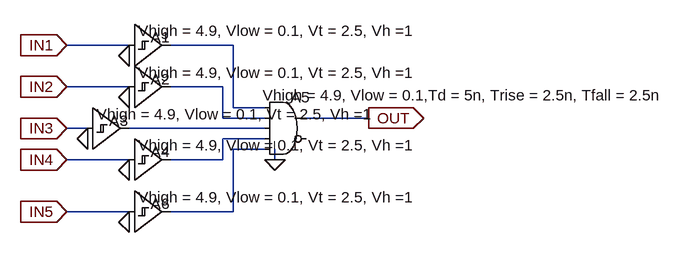
[diagram p0: schematic Draft1.asc]
Draft1.asc, the LTspice schematic file:
Version 4.1
SHEET 1 880 680
WIRE 48 -544 -48 -544
WIRE 208 -544 112 -544
WIRE 48 -480 -48 -480
WIRE 192 -480 112 -480
WIRE 208 -448 208 -544
WIRE 256 -448 208 -448
WIRE 192 -432 192 -480
WIRE 256 -432 192 -432
WIRE 416 -432 320 -432
WIRE -16 -416 -48 -416
WIRE 256 -416 48 -416
WIRE 256 -400 192 -400
WIRE 256 -384 208 -384
WIRE 48 -368 -48 -368
WIRE 192 -368 192 -400
WIRE 192 -368 112 -368
WIRE 272 -368 272 -384
WIRE 48 -288 -48 -288
WIRE 208 -288 208 -384
WIRE 208 -288 112 -288
FLAG 48 -528 0
FLAG 48 -464 0
FLAG 48 -352 0
FLAG 48 -272 0
FLAG -16 -400 0
FLAG 272 -368 0
FLAG -48 -544 IN1
IOPIN -48 -544 In
FLAG -48 -480 IN2
IOPIN -48 -480 In
FLAG -48 -416 IN3
IOPIN -48 -416 In
FLAG -48 -368 IN4
IOPIN -48 -368 In
FLAG -48 -288 IN5
IOPIN -48 -288 In
FLAG 416 -432 OUT
IOPIN 416 -432 Out
SYMBOL Digital\\schmtbuf 48 -608 R0
WINDOW 0 33 52 Left 0
WINDOW 3 14 42 Left 0
SYMATTR InstName A1
SYMATTR Value Vhigh = 4.9, Vlow = 0.1, Vt = 2.5, Vh =1
SYMBOL Digital\\schmtbuf 48 -544 R0
WINDOW 0 33 52 Left 0
WINDOW 3 14 42 Left 0
SYMATTR InstName A2
SYMATTR Value Vhigh = 4.9, Vlow = 0.1, Vt = 2.5, Vh =1
SYMBOL Digital\\schmtbuf -16 -480 R0
WINDOW 0 33 52 Left 0
WINDOW 3 14 42 Left 0
SYMATTR InstName A3
SYMATTR Value Vhigh = 4.9, Vlow = 0.1, Vt = 2.5, Vh =1
SYMBOL Digital\\schmtbuf 48 -432 R0
WINDOW 0 33 52 Left 0
WINDOW 3 14 42 Left 0
SYMATTR InstName A4
SYMATTR Value Vhigh = 4.9, Vlow = 0.1, Vt = 2.5, Vh =1
SYMBOL Digital\\and 288 -480 R0
WINDOW 3 -35 13 Left 0
SYMATTR Value Vhigh = 4.9, Vlow = 0.1,Td = 5n, Trise = 2.5n, Tfall = 2.5n
SYMATTR InstName A5
SYMBOL Digital\\schmtbuf 48 -352 R0
WINDOW 0 33 52 Left 0
WINDOW 3 14 42 Left 0
SYMATTR InstName A6
SYMATTR Value Vhigh = 4.9, Vlow = 0.1, Vt = 2.5, Vh =1

The netlist it stands for:
* Draft1.asc
A1 IN1 0 0 0 0 0 N001 0 SCHMITT Vhigh = 4.9, Vlow = 0.1, Vt = 2.5, Vh =1
A2 IN2 0 0 0 0 0 N002 0 SCHMITT Vhigh = 4.9, Vlow = 0.1, Vt = 2.5, Vh =1
A3 IN3 0 0 0 0 0 N003 0 SCHMITT Vhigh = 4.9, Vlow = 0.1, Vt = 2.5, Vh =1
A4 IN4 0 0 0 0 0 N004 0 SCHMITT Vhigh = 4.9, Vlow = 0.1, Vt = 2.5, Vh =1
A5 N001 N002 N003 N004 N005 0 OUT 0 AND Vhigh = 4.9, Vlow = 0.1,Td = 5n, Trise = 2.5n, Tfall = 2.5n
A6 IN5 0 0 0 0 0 N005 0 SCHMITT Vhigh = 4.9, Vlow = 0.1, Vt = 2.5, Vh =1
.backanno
.end